# Altium schematic sheet Reefing-PSU.SchDoc: Reefing System
size A4; DocumentNumber: Subtitle; Revision: V1.0; SheetNumber: 4; SheetTotal: 13; Author: Luca Jost; Subtitle: Power Supply
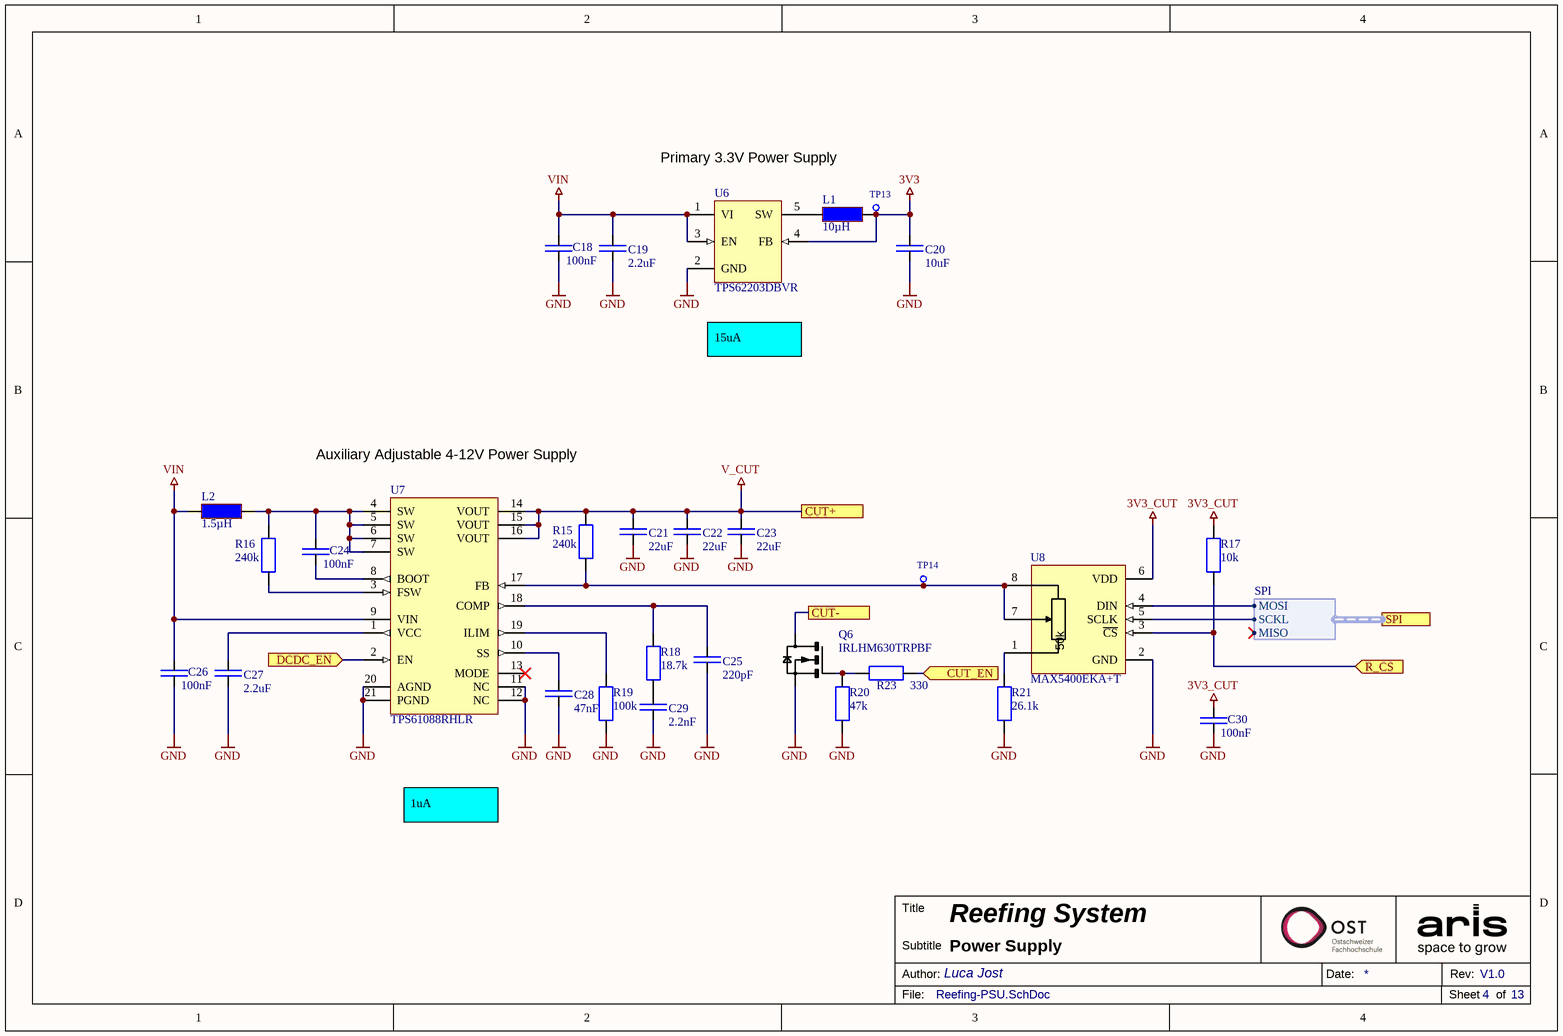
[diagram p0: Reefing-PSU.SchDoc]

## Parts
C18  100nF  [SMD Keramikkondensator 0402]
C19  2.2uF  [SMD Keramikkondensator 0402]
C20  10uF  [SMD Keramikkondensator 0603]
C21  22uF  [SMD Keramikkondensator 0805]
C22  22uF  [SMD Keramikkondensator 0805]
C23  22uF  [SMD Keramikkondensator 0805]
C24  100nF  [SMD Keramikkondensator 0402]
C25  220pF  [SMD Keramikkondensator 0402]
C26  100nF  [SMD Keramikkondensator 0402]
C27  2.2uF  [SMD Keramikkondensator 0402]
C28  47nF  [SMD Keramikkondensator 0402]
C29  2.2nF  [SMD Keramikkondensator 0402]
C30  100nF  [SMD Keramikkondensator 0402]
L1  10µH  [SMD Inductor 4x4x1.8]
L2  1.5µH  [SMD Inductor 7.1x6.6]
Q6  IRLHM630TRPBF  [SMD MOSFET DFN 3.3x3.3]
R15  240k  [SMD Widerstand 0402]
R16  240k  [SMD Widerstand 0402]
R17  10k  [SMD Widerstand 0402]
R18  18.7k  [SMD Widerstand 0402]
R19  100k  [SMD Widerstand 0402]
R20  47k  [SMD Widerstand 0402]
R21  26.1k  [SMD Widerstand 0402]
R23  330  [SMD Widerstand 0402]
TP13  X-TP  [SMD Testpoint 1mm]  (value not drawn)  (no BOM)
TP14  X-TP  [SMD Testpoint 1mm]  (value not drawn)  (no BOM)
U6  TPS62203DBVR  [SMD IC SOT-23-5]
U7  TPS61088RHLR  [SMD IC VQFN-20]
U8  MAX5400EKA+T  [SMD IC SOT-23-8]

## Ports
CUT+, CUT-, CUT_EN (in), DCDC_EN (in), R_CS (in), SPI (harness SPI)

## Harnesses
SPI: SCKL, MOSI, MISO

## Nets
3V3: C20.2 L1.2 TP13.1 U6.4(FB)
3V3_CUT: C30.2 R17.2 U8.6(VDD)
GND: C18.1 C19.1 C20.1 C21.1 C22.1 C23.1 C25.1 C26.1 C27.1 C28.1 C29.1 C30.1 Q6.S R19.1 R20.1 R21.1 U6.2(GND) U7.11(NC) U7.12(NC) U7.20(AGND) U7.21(PGND) U8.2(GND)
V_CUT: C21.2 C22.2 C23.2 R15.2 U7.14(VOUT) U7.15(VOUT) U7.16(VOUT) ; port CUT+
VIN: C18.2 C19.2 C26.2 L2.1 U6.1(VI) U6.3(EN) U7.9(VIN)
CUT-: Q6.D ; port CUT-
CUT_EN: R23.1 ; port CUT_EN
DCDC_EN: U7.2(EN) ; port DCDC_EN
R_CS: R17.1 U8.3(~{CS}) ; port R_CS
NetC24_1: C24.1 U7.8(BOOT)
NetC24_2: C24.2 L2.2 R16.2 U7.4(SW) U7.5(SW) U7.6(SW) U7.7(SW)
NetC25_2: C25.2 R18.2 U7.18(COMP)
NetC27_2: C27.2 U7.1(VCC)
NetC28_2: C28.2 U7.10(SS)
NetC29_2: C29.2 R18.1
NetL1_1: L1.1 U6.5(SW)
NetQ6_G: Q6.G R20.2 R23.2
NetR15_1: R15.1 TP14.1 U7.17(FB) U8.7(W) U8.8(H)
NetR16_1: R16.1 U7.3(FSW)
NetR19_2: R19.2 U7.19(ILIM)
NetR21_2: R21.2 U8.1(L)
NetU8_4: U8.4(DIN) ; port SPI.MOSI
NetU8_5: U8.5(SCLK) ; port SPI.SCKL

Not connected (* = marked no-connect by the designer): U7 13(MODE)*

## Notes on the sheet
- Primary 3.3V Power Supply
- 15uA
- Auxiliary Adjustable 4-12V Power Supply
- 1uA
- Title
- Author:
- Subtitle
- Date:
- Rev:
- File:
- Sheet
- of
- (in symbol MAX5400EKA+T) 50k

## Library data of the parts
C18 C24 C26 C30 = E6 - 100nF: SMD Ceramic Capacitor E6; Unit Price: 0.01; JLC: C307331
C19 C27 = E6 - 2.2uF: SMD Ceramic Capacitor E6; Unit Price: 0.01; JLC: C193620
C20 = E6 - 10uF: SMD Ceramic Capacitor E6; Unit Price: 0.01; JLC: C70225
C21-C23 = E6 - 22uF: SMD Ceramic Capacitor E6; Unit Price: 0.01; JLC: C45783
C25 = E6 - 220pF: SMD Ceramic Capacitor E6; Unit Price: 0.01; JLC: C1530
C28 = E6 - 47nF: SMD Ceramic Capacitor E6; Unit Price: 0.01; JLC: C338148
C29 = E6 - 2.2nF: SMD Ceramic Capacitor E6; Unit Price: 0.01; JLC: C1531
L1 = Inductor 10µH / 1.6A: 165mOhm SMD, 1.6A; ComponentLink1Description: Datasheet; ComponentLink1URL: https://datasheet.lcsc.com/lcsc/2108131530_SXN-Shun-Xiang-Nuo-Elec-SMNR4020-10UH_C135263.pdf; JLC: C135263; Unit Price: 0.07
L2 = Inductor 1.5µH / 10A: 8.5mΩ SMD, 7.1x6.6x5mm; ComponentLink1Description: Datasheet; ComponentLink1URL: https://datasheet.lcsc.com/lcsc/2108131730_SXN-Shun-Xiang-Nuo-Elec-SMMS0650-1R5M_C149579.pdf; JLC: C149579; Unit Price: 0.19
Q6 = IRLHM630TRPBF: N-Channel 30V 21A 3.5mOhm@4.5V; JLC: C148139; ComponentLink1Description: Datasheet; ComponentLink1URL: https://datasheet.lcsc.com/lcsc/1808281623_Infineon-Technologies-IRLHM630TRPBF_C148139.pdf; Unit Price: 0.76
R15 R16 = E24 - 240k: SMD Chip Resistor E24; Unit Price: 0.01; JLC: C64043
R17 = E24 - 10k: SMD Chip Resistor E24; Unit Price: 0.01; JLC: C25744
R18 = E96 - 18.7k: SMD Chip Resistor E96; Unit Price: 0.01; JLC: C11476
R19 = E24 - 100k: SMD Chip Resistor E24; Unit Price: 0.01; JLC: C25741
R20 = E24 - 47k: SMD Chip Resistor E24; Unit Price: 0.01; JLC: C25792
R21 = E96 - 26.1k: SMD Chip Resistor E96; Unit Price: 0.01; JLC: C407739
R23 = E24 - 330: SMD Chip Resistor E24; Unit Price: 0.01; JLC: C25104
TP13 TP14 = X-TP: Testpunkt; Unit Price: 0.00
U6 = TPS62203DBVR: High-Efficiency Synchronous Step-Down / synchronous step-down converters ideally suited for Converter 3.3V; ComponentLink1Description: Datasheet; ComponentLink1URL: https://www.ti.com/lit/ds/symlink/tps62203.pdf?HQS=dis-mous-null-mousermode-dsf-pf-null-wwe&ts=1645451444570&ref_url=https%253A%252F%252Fwww.mouser.ch%252F; JLC: C9051; Unit Price: 1.03
U7 = TPS61088RHLR: 10-A Fully-Integrated Synchronous Boost Converter; ComponentLink1Description: Datasheet; ComponentLink1URL: https://www.ti.com/lit/ds/symlink/tps61088.pdf?HQS=dis-mous-null-mousermode-dsf-pf-null-wwe&ts=1645456492039&ref_url=https%253A%252F%252Fwww.mouser.ch%252F; JLC: C87357; Unit Price: 2.57
U8 = MAX5400EKA+T: Low-Drift Digital Potentiometer; ComponentLink1Description: Datasheet; ComponentLink1URL: https://datasheet.lcsc.com/lcsc/2105241240_Maxim-Integrated-MAX5400EKA-T_C516784.pdf; JLC: C516784; Unit Price: 1.99